# EAGLE schematic LEDCube_Par (EAGLE 5.09)
REICHELT: TASTER 3301
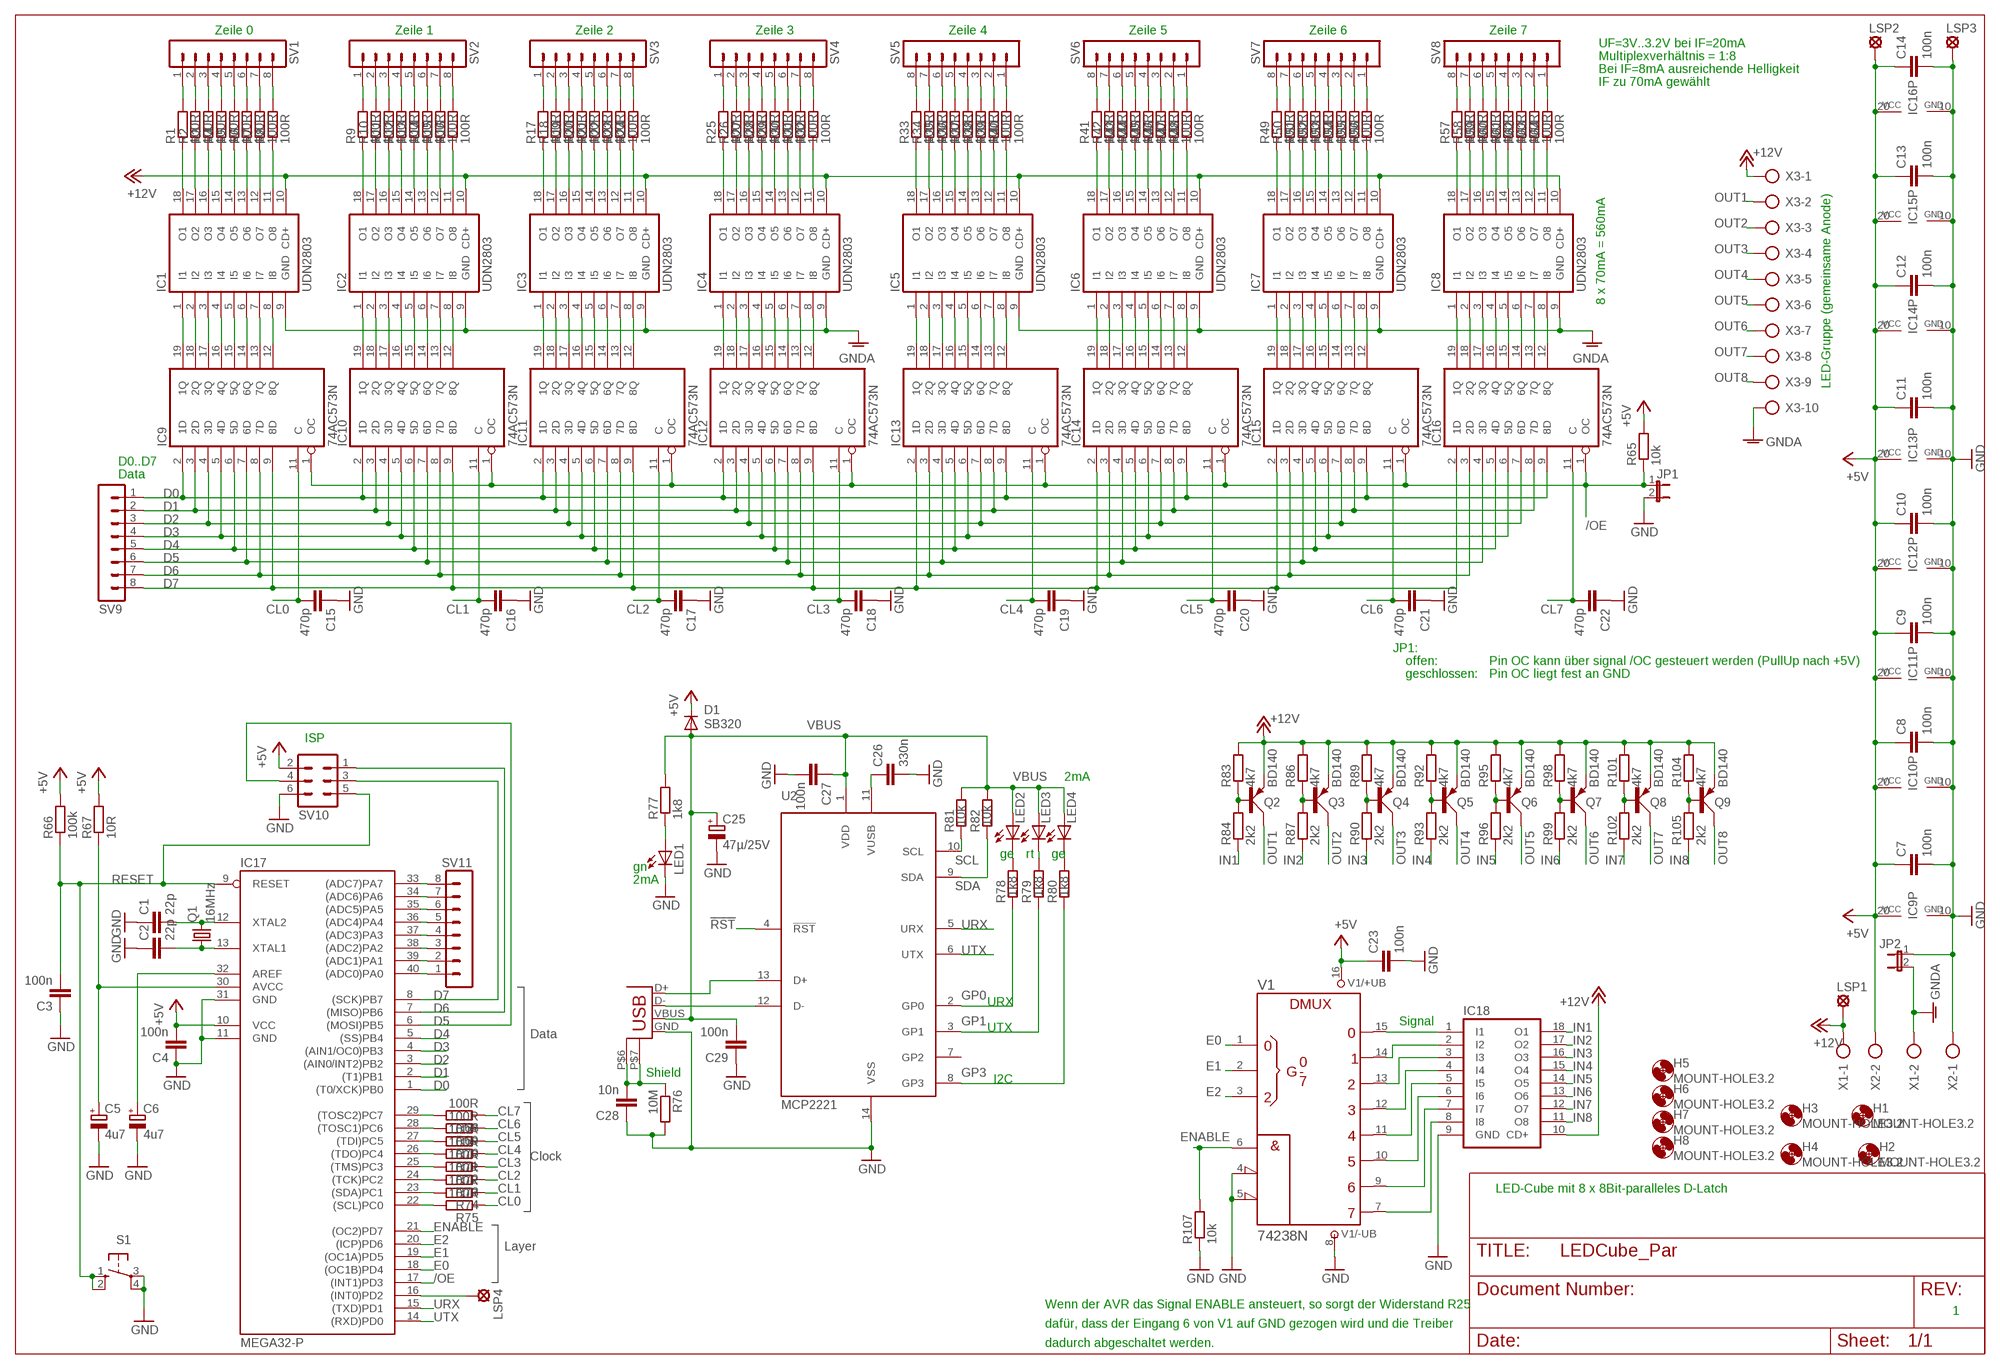
[diagram p0: schematic, sheet 1]

## Parts
C1  22p  C-EU050-025X075  [C050-025X075]
C2  22p  C-EU050-025X075  [C050-025X075]
C3  100n  C-EU050-025X075  [C050-025X075]
C4  100n  C-EU050-025X075  [C050-025X075]
C5  4u7  CPOL-EUE2-5  [E2-5]
C6  4u7  CPOL-EUE2-5  [E2-5]
C7  100n  C-EU050-030X075  [C050-030X075]
C8  100n  C-EU050-030X075  [C050-030X075]
C9  100n  C-EU050-030X075  [C050-030X075]
C10  100n  C-EU050-030X075  [C050-030X075]
C11  100n  C-EU050-030X075  [C050-030X075]
C12  100n  C-EU050-030X075  [C050-030X075]
C13  100n  C-EU050-030X075  [C050-030X075]
C14  100n  C-EU050-030X075  [C050-030X075]
C15  470p  C-EU050-025X075  [C050-025X075]
C16  470p  C-EU050-025X075  [C050-025X075]
C17  470p  C-EU050-025X075  [C050-025X075]
C18  470p  C-EU050-025X075  [C050-025X075]
C19  470p  C-EU050-025X075  [C050-025X075]
C20  470p  C-EU050-025X075  [C050-025X075]
C21  470p  C-EU050-025X075  [C050-025X075]
C22  470p  C-EU050-025X075  [C050-025X075]
C23  100n  C-EU050-025X075  [C050-025X075]
C25  47µ/25V  CPOL-EUE2-5  [E2-5]
C26  330n  C-EU050-030X075  [C050-030X075]
C27  100n  C-EU050-030X075  [C050-030X075]
C28  10n  C-EU050-030X075  [C050-030X075]
C29  100n  C-EU050-030X075  [C050-030X075]
C30  USB_SHIELED  [USB-MB-H-SHIELD]
D1  SB320  [DO201-15]
H1  MOUNT-HOLE3.2  [3,2]
H2  MOUNT-HOLE3.2  [3,2]
H3  MOUNT-HOLE3.2  [3,2]
H4  MOUNT-HOLE3.2  [3,2]
H5  MOUNT-HOLE3.2  [3,2]
H6  MOUNT-HOLE3.2  [3,2]
H7  MOUNT-HOLE3.2  [3,2]
H8  MOUNT-HOLE3.2  [3,2]
IC1  UDN2803  ULN2803A  [DIL18]
IC2  UDN2803  ULN2803A  [DIL18]
IC3  UDN2803  ULN2803A  [DIL18]
IC4  UDN2803  ULN2803A  [DIL18]
IC5  UDN2803  ULN2803A  [DIL18]
IC6  UDN2803  ULN2803A  [DIL18]
IC7  UDN2803  ULN2803A  [DIL18]
IC8  UDN2803  ULN2803A  [DIL18]
IC9  74AC573N  [DIL20]
IC10  74AC573N  [DIL20]
IC11  74AC573N  [DIL20]
IC12  74AC573N  [DIL20]
IC13  74AC573N  [DIL20]
IC14  74AC573N  [DIL20]
IC15  74AC573N  [DIL20]
IC16  74AC573N  [DIL20]
IC17  MEGA32-P  [DIL40]
IC18  ULN2803A  [DIL18]
JP1  JP1E  [JP1]
JP2  JP1E  [JP1]
LED1  LED3MM  [LED3MM]
LED2  LED3MM  [LED3MM]
LED3  LED3MM  [LED3MM]
LED4  LED3MM  [LED3MM]
LSP1  LSP10  [LSP10]
LSP2  LSP10  [LSP10]
LSP3  LSP10  [LSP10]
LSP4  LSP11  [LSP11]
Q1  16MHz  CRYSTALHC49U-V  [HC49U-V]
Q2  BD140  [TO126AV]
Q3  BD140  [TO126AV]
Q4  BD140  [TO126AV]
Q5  BD140  [TO126AV]
Q6  BD140  [TO126AV]
Q7  BD140  [TO126AV]
Q8  BD140  [TO126AV]
Q9  BD140  [TO126AV]
R1  100R  R-EU_0204/2V  [0204V]
R2  100R  R-EU_0204/2V  [0204V]
R3  100R  R-EU_0204/2V  [0204V]
R4  100R  R-EU_0204/2V  [0204V]
R5  100R  R-EU_0204/2V  [0204V]
R6  100R  R-EU_0204/2V  [0204V]
R7  100R  R-EU_0204/2V  [0204V]
R8  100R  R-EU_0204/2V  [0204V]
R9  100R  R-EU_0204/2V  [0204V]
R10  100R  R-EU_0204/2V  [0204V]
R11  100R  R-EU_0204/2V  [0204V]
R12  100R  R-EU_0204/2V  [0204V]
R13  100R  R-EU_0204/2V  [0204V]
R14  100R  R-EU_0204/2V  [0204V]
R15  100R  R-EU_0204/2V  [0204V]
R16  100R  R-EU_0204/2V  [0204V]
R17  100R  R-EU_0204/2V  [0204V]
R18  100R  R-EU_0204/2V  [0204V]
R19  100R  R-EU_0204/2V  [0204V]
R20  100R  R-EU_0204/2V  [0204V]
R21  100R  R-EU_0204/2V  [0204V]
R22  100R  R-EU_0204/2V  [0204V]
R23  100R  R-EU_0204/2V  [0204V]
R24  100R  R-EU_0204/2V  [0204V]
R25  100R  R-EU_0204/2V  [0204V]
R26  100R  R-EU_0204/2V  [0204V]
R27  100R  R-EU_0204/2V  [0204V]
R28  100R  R-EU_0204/2V  [0204V]
R29  100R  R-EU_0204/2V  [0204V]
R30  100R  R-EU_0204/2V  [0204V]
R31  100R  R-EU_0204/2V  [0204V]
R32  100R  R-EU_0204/2V  [0204V]
R33  100R  R-EU_0204/2V  [0204V]
R34  100R  R-EU_0204/2V  [0204V]
R35  100R  R-EU_0204/2V  [0204V]
R36  100R  R-EU_0204/2V  [0204V]
R37  100R  R-EU_0204/2V  [0204V]
R38  100R  R-EU_0204/2V  [0204V]
R39  100R  R-EU_0204/2V  [0204V]
R40  100R  R-EU_0204/2V  [0204V]
R41  100R  R-EU_0204/2V  [0204V]
R42  100R  R-EU_0204/2V  [0204V]
R43  100R  R-EU_0204/2V  [0204V]
R44  100R  R-EU_0204/2V  [0204V]
R45  100R  R-EU_0204/2V  [0204V]
R46  100R  R-EU_0204/2V  [0204V]
R47  100R  R-EU_0204/2V  [0204V]
R48  100R  R-EU_0204/2V  [0204V]
R49  100R  R-EU_0204/2V  [0204V]
R50  100R  R-EU_0204/2V  [0204V]
R51  100R  R-EU_0204/2V  [0204V]
R52  100R  R-EU_0204/2V  [0204V]
R53  100R  R-EU_0204/2V  [0204V]
R54  100R  R-EU_0204/2V  [0204V]
R55  100R  R-EU_0204/2V  [0204V]
R56  100R  R-EU_0204/2V  [0204V]
R57  100R  R-EU_0204/2V  [0204V]
R58  100R  R-EU_0204/2V  [0204V]
R59  100R  R-EU_0204/2V  [0204V]
R60  100R  R-EU_0204/2V  [0204V]
R61  100R  R-EU_0204/2V  [0204V]
R62  100R  R-EU_0204/2V  [0204V]
R63  100R  R-EU_0204/2V  [0204V]
R64  100R  R-EU_0204/2V  [0204V]
R65  10k  R-EU_0207/10  [0207/10]
R66  100k  R-EU_0207/10  [0207/10]
R67  10R  R-EU_0207/10  [0207/10]
R68  100R  R-EU_0207/2V  [0207/2V]
R69  100R  R-EU_0207/2V  [0207/2V]
R70  100R  R-EU_0207/2V  [0207/2V]
R71  100R  R-EU_0207/2V  [0207/2V]
R72  100R  R-EU_0207/2V  [0207/2V]
R73  100R  R-EU_0207/2V  [0207/2V]
R74  100R  R-EU_0207/2V  [0207/2V]
R75  100R  R-EU_0207/2V  [0207/2V]
R76  10M  R-EU_0207/10  [0207/10]
R77  1k8  R-EU_0207/2V  [0207/2V]
R78  1k8  R-EU_0207/2V  [0207/2V]
R79  1k8  R-EU_0207/2V  [0207/2V]
R80  1k8  R-EU_0207/2V  [0207/2V]
R81  10k  R-EU_0207/2V  [0207/2V]
R82  10k  R-EU_0207/2V  [0207/2V]
R83  4k7  R-EU_0207/10  [0207/10]
R84  2k2  R-EU_0207/2V  [0207/2V]
R86  4k7  R-EU_0207/10  [0207/10]
R87  2k2  R-EU_0207/2V  [0207/2V]
R89  4k7  R-EU_0207/10  [0207/10]
R90  2k2  R-EU_0207/2V  [0207/2V]
R92  4k7  R-EU_0207/10  [0207/10]
R93  2k2  R-EU_0207/2V  [0207/2V]
R95  4k7  R-EU_0207/10  [0207/10]
R96  2k2  R-EU_0207/2V  [0207/2V]
R98  4k7  R-EU_0207/10  [0207/10]
R99  2k2  R-EU_0207/2V  [0207/2V]
R101  4k7  R-EU_0207/10  [0207/10]
R102  2k2  R-EU_0207/2V  [0207/2V]
R104  4k7  R-EU_0207/10  [0207/10]
R105  2k2  R-EU_0207/2V  [0207/2V]
R107  10k  R-EU_0207/10  [0207/10]
S1  10-XX  [B3F-10XX]
SV1  MA08-1  [MA08-1]
SV2  MA08-1  [MA08-1]
SV3  MA08-1  [MA08-1]
SV4  MA08-1  [MA08-1]
SV5  MA08-1  [MA08-1]
SV6  MA08-1  [MA08-1]
SV7  MA08-1  [MA08-1]
SV8  MA08-1  [MA08-1]
SV9  MA08-1  [MA08-1]
SV10  ML6  [ML6]
SV11  MA08-1  [MA08-1]
U2  MCP2221  [DIL14]
V1  74238N  [DIL16]
X1  AK500/2  [AK500/2]
X2  AK500/2  [AK500/2]
X3  AK500/10  [AK500/10]

## Nets
!RST: U2.4(!RST)
+5V: C4.2 C7.1 C8.1 C9.1 C10.1 C11.1 C12.1 C13.1 C14.1 C23.1 D1.C IC9.20(VCC) IC10.20(VCC) IC11.20(VCC) IC12.20(VCC) IC13.20(VCC) IC14.20(VCC) IC15.20(VCC) IC16.20(VCC) IC17.10(VCC) LSP2.MP R65.2 R66.2 R67.2 SV10.2 V1.16(+UB) X2.2
+12V: IC1.10(CD+) IC2.10(CD+) IC3.10(CD+) IC4.10(CD+) IC5.10(CD+) IC6.10(CD+) IC7.10(CD+) IC8.10(CD+) IC18.10(CD+) LSP1.MP Q2.E Q3.E Q4.E Q5.E Q6.E Q7.E Q8.E Q9.E R83.2 R86.2 R89.2 R92.2 R95.2 R98.2 R101.2 R104.2 X1.1 X3.1
/OE: IC9.1(OC) IC10.1(OC) IC11.1(OC) IC12.1(OC) IC13.1(OC) IC14.1(OC) IC15.1(OC) IC16.1(OC) IC17.17((INT1)PD3) JP1.1 R65.1
CL0: C15.2 IC9.11(C) R75.1
CL1: C16.2 IC10.11(C) R74.1
CL2: C17.2 IC11.11(C) R73.1
CL3: C18.2 IC12.11(C) R72.1
CL4: C19.2 IC13.11(C) R71.1
CL5: C20.2 IC14.11(C) R70.1
CL6: C21.2 IC15.11(C) R69.1
CL7: C22.2 IC16.11(C) R68.1
D0: IC9.2(1D) IC10.2(1D) IC11.2(1D) IC12.2(1D) IC13.9(8D) IC14.9(8D) IC15.9(8D) IC16.9(8D) IC17.1((T0/XCK)PB0) SV9.1
D1: IC9.3(2D) IC10.3(2D) IC11.3(2D) IC12.3(2D) IC13.8(7D) IC14.8(7D) IC15.8(7D) IC16.8(7D) IC17.2((T1)PB1) SV9.2
D2: IC9.4(3D) IC10.4(3D) IC11.4(3D) IC12.4(3D) IC13.7(6D) IC14.7(6D) IC15.7(6D) IC16.7(6D) IC17.3((AIN0/INT2)PB2) SV9.3
D3: IC9.5(4D) IC10.5(4D) IC11.5(4D) IC12.5(4D) IC13.6(5D) IC14.6(5D) IC15.6(5D) IC16.6(5D) IC17.4((AIN1/OC0)PB3) SV9.4
D4: IC9.6(5D) IC10.6(5D) IC11.6(5D) IC12.6(5D) IC13.5(4D) IC14.5(4D) IC15.5(4D) IC16.5(4D) IC17.5((SS)PB4) SV9.5
D5: IC9.7(6D) IC10.7(6D) IC11.7(6D) IC12.7(6D) IC13.4(3D) IC14.4(3D) IC15.4(3D) IC16.4(3D) IC17.6((MOSI)PB5) SV9.6 SV10.4
D6: IC9.8(7D) IC10.8(7D) IC11.8(7D) IC12.8(7D) IC13.3(2D) IC14.3(2D) IC15.3(2D) IC16.3(2D) IC17.7((MISO)PB6) SV9.7 SV10.1
D7: IC9.9(8D) IC10.9(8D) IC11.9(8D) IC12.9(8D) IC13.2(1D) IC14.2(1D) IC15.2(1D) IC16.2(1D) IC17.8((SCK)PB7) SV9.8 SV10.3
E0: IC17.18((OC1B)PD4) V1.1(A)
E1: IC17.19((OC1A)PD5) V1.2(B)
E2: IC17.20((ICP)PD6) V1.3(C)
ENABLE: IC17.21((OC2)PD7) R107.2 V1.6(G1)
GND: C1.1 C2.1 C3.1 C4.1 C5.- C6.- C7.2 C8.2 C9.2 C10.2 C11.2 C12.2 C13.2 C14.2 C15.1 C16.1 C17.1 C18.1 C19.1 C20.1 C21.1 C22.1 C23.2 C25.- C26.2 C27.2 C28.1 C29.1 C30.GND IC9.10(GND) IC10.10(GND) IC11.10(GND) IC12.10(GND) IC13.10(GND) IC14.10(GND) IC15.10(GND) IC16.10(GND) IC17.11(GND) IC17.31(GND) IC18.9(GND) JP1.2 JP2.1 LED1.K(C) LSP3.MP R76.2 R107.1 S1.3(P) S1.4(P1) SV10.6 U2.14(VSS) V1.4(!G2A) V1.5(!G2B) V1.8(-UB) X2.1
GNDA: IC1.9(GND) IC2.9(GND) IC3.9(GND) IC4.9(GND) IC5.9(GND) IC6.9(GND) IC7.9(GND) IC8.9(GND) JP2.2 X1.2 X3.10
GP0: R78.1 U2.2(GP0)
GP1: R79.1 U2.3(GP1)
GP3: R80.1 U2.8(GP3)
IN1: IC18.18(O1) R84.1
IN2: IC18.17(O2) R87.1
IN3: IC18.16(O3) R90.1
IN4: IC18.15(O4) R93.1
IN5: IC18.14(O5) R96.1
IN6: IC18.13(O6) R99.1
IN7: IC18.12(O7) R102.1
IN8: IC18.11(O8) R105.1
N$1: IC1.1(I1) IC9.19(1Q)
N$2: IC1.2(I2) IC9.18(2Q)
N$3: IC1.3(I3) IC9.17(3Q)
N$4: IC1.4(I4) IC9.16(4Q)
N$5: IC1.5(I5) IC9.15(5Q)
N$6: IC1.6(I6) IC9.14(6Q)
N$7: IC1.7(I7) IC9.13(7Q)
N$8: IC1.8(I8) IC9.12(8Q)
N$9: IC2.1(I1) IC10.19(1Q)
N$10: IC2.2(I2) IC10.18(2Q)
N$11: IC2.3(I3) IC10.17(3Q)
N$12: IC2.4(I4) IC10.16(4Q)
N$13: IC2.5(I5) IC10.15(5Q)
N$14: IC2.6(I6) IC10.14(6Q)
N$15: IC2.7(I7) IC10.13(7Q)
N$16: IC2.8(I8) IC10.12(8Q)
N$17: IC3.1(I1) IC11.19(1Q)
N$18: IC3.2(I2) IC11.18(2Q)
N$19: IC3.3(I3) IC11.17(3Q)
N$20: IC3.4(I4) IC11.16(4Q)
N$21: IC3.5(I5) IC11.15(5Q)
N$22: IC3.6(I6) IC11.14(6Q)
N$23: IC3.7(I7) IC11.13(7Q)
N$24: IC3.8(I8) IC11.12(8Q)
N$25: IC4.1(I1) IC12.19(1Q)
N$26: IC4.2(I2) IC12.18(2Q)
N$27: IC4.3(I3) IC12.17(3Q)
N$28: IC4.4(I4) IC12.16(4Q)
N$29: IC4.5(I5) IC12.15(5Q)
N$30: IC4.6(I6) IC12.14(6Q)
N$31: IC4.7(I7) IC12.13(7Q)
N$32: IC4.8(I8) IC12.12(8Q)
N$33: IC17.16((INT0)PD2) LSP4.MP
N$34: R49.2 SV7.8
N$35: R50.2 SV7.7
N$36: R51.2 SV7.6
N$37: R52.2 SV7.5
N$38: R53.2 SV7.4
N$39: R54.2 SV7.3
N$40: R55.2 SV7.2
N$41: R56.2 SV7.1
N$42: IC2.18(O1) R9.1
N$43: IC1.18(O1) R1.1
N$44: R41.2 SV6.8
N$45: IC5.1(I1) IC13.19(1Q)
N$46: IC5.2(I2) IC13.18(2Q)
N$47: IC5.3(I3) IC13.17(3Q)
N$48: IC1.17(O2) R2.1
N$49: IC1.16(O3) R3.1
N$50: IC1.15(O4) R4.1
N$51: IC1.14(O5) R5.1
N$52: IC1.13(O6) R6.1
N$53: IC1.12(O7) R7.1
N$54: IC1.11(O8) R8.1
N$55: IC4.11(O8) R32.1
N$56: IC4.12(O7) R31.1
N$57: IC4.13(O6) R30.1
N$58: IC4.14(O5) R29.1
N$59: IC4.15(O4) R28.1
N$60: IC4.16(O3) R27.1
N$61: IC4.17(O2) R26.1
N$62: IC4.18(O1) R25.1
N$63: R1.2 SV1.1
N$64: IC5.4(I4) IC13.16(4Q)
N$65: IC2.17(O2) R10.1
N$66: IC5.5(I5) IC13.15(5Q)
N$67: IC2.16(O3) R11.1
N$68: IC5.6(I6) IC13.14(6Q)
N$69: IC5.7(I7) IC13.13(7Q)
N$70: IC2.15(O4) R12.1
N$71: IC5.8(I8) IC13.12(8Q)
N$72: IC6.1(I1) IC14.19(1Q)
N$73: IC6.2(I2) IC14.18(2Q)
N$74: IC6.3(I3) IC14.17(3Q)
N$75: IC2.14(O5) R13.1
N$76: IC2.13(O6) R14.1
N$77: IC2.12(O7) R15.1
N$78: IC2.11(O8) R16.1
N$79: IC3.18(O1) R17.1
N$80: IC3.17(O2) R18.1
N$81: IC3.16(O3) R19.1
N$82: IC3.15(O4) R20.1
N$83: IC3.14(O5) R21.1
N$84: IC3.13(O6) R22.1
N$85: IC3.12(O7) R23.1
N$86: IC6.4(I4) IC14.16(4Q)
N$87: IC6.5(I5) IC14.15(5Q)
N$88: IC3.11(O8) R24.1
N$89: IC6.6(I6) IC14.14(6Q)
N$90: IC6.7(I7) IC14.13(7Q)
N$91: IC6.8(I8) IC14.12(8Q)
N$92: IC7.1(I1) IC15.19(1Q)
N$93: IC7.2(I2) IC15.18(2Q)
N$94: IC7.3(I3) IC15.17(3Q)
N$95: IC7.4(I4) IC15.16(4Q)
N$96: IC7.5(I5) IC15.15(5Q)
N$97: IC7.6(I6) IC15.14(6Q)
N$98: IC7.7(I7) IC15.13(7Q)
N$99: IC7.8(I8) IC15.12(8Q)
N$100: IC8.1(I1) IC16.19(1Q)
N$101: IC8.2(I2) IC16.18(2Q)
N$102: IC8.3(I3) IC16.17(3Q)
N$103: IC8.4(I4) IC16.16(4Q)
N$104: IC8.5(I5) IC16.15(5Q)
N$105: IC8.6(I6) IC16.14(6Q)
N$106: IC8.7(I7) IC16.13(7Q)
N$107: C1.2 IC17.12(XTAL2) Q1.2
N$108: IC8.8(I8) IC16.12(8Q)
N$109: R42.2 SV6.7
N$110: R43.2 SV6.6
N$111: R44.2 SV6.5
N$112: R45.2 SV6.4
N$113: R46.2 SV6.3
N$114: R47.2 SV6.2
N$115: R48.2 SV6.1
N$116: Q2.B R83.1 R84.2
N$117: IC5.18(O1) R33.1
N$118: IC5.17(O2) R34.1
N$119: IC5.16(O3) R35.1
N$120: IC5.15(O4) R36.1
N$121: IC5.14(O5) R37.1
N$122: R2.2 SV1.2
N$123: R3.2 SV1.3
N$124: R4.2 SV1.4
N$125: R5.2 SV1.5
N$126: R6.2 SV1.6
N$127: R7.2 SV1.7
N$128: R8.2 SV1.8
N$129: R9.2 SV2.1
N$130: IC5.13(O6) R38.1
N$131: IC5.12(O7) R39.1
N$132: IC5.11(O8) R40.1
N$133: IC8.11(O8) R64.1
N$134: IC8.12(O7) R63.1
N$135: IC8.13(O6) R62.1
N$136: IC8.14(O5) R61.1
N$137: IC8.15(O4) R60.1
N$138: IC8.16(O3) R59.1
N$139: IC8.17(O2) R58.1
N$140: IC8.18(O1) R57.1
N$141: IC6.18(O1) R41.1
N$142: IC6.17(O2) R42.1
N$143: IC6.16(O3) R43.1
N$144: IC6.15(O4) R44.1
N$145: IC6.14(O5) R45.1
N$146: IC6.13(O6) R46.1
N$147: IC6.12(O7) R47.1
N$148: IC6.11(O8) R48.1
N$149: IC7.18(O1) R49.1
N$150: R10.2 SV2.2
N$151: IC7.17(O2) R50.1
N$152: IC7.16(O3) R51.1
N$153: IC7.15(O4) R52.1
N$154: IC7.14(O5) R53.1
N$155: IC7.13(O6) R54.1
N$156: IC7.12(O7) R55.1
N$157: IC7.11(O8) R56.1
N$158: R33.2 SV5.8
N$159: R34.2 SV5.7
N$160: R35.2 SV5.6
N$161: R36.2 SV5.5
N$162: R37.2 SV5.4
N$163: R38.2 SV5.3
N$164: R39.2 SV5.2
N$165: R40.2 SV5.1
N$166: R57.2 SV8.8
N$167: R11.2 SV2.3
N$168: R12.2 SV2.4
N$169: R13.2 SV2.5
N$170: R14.2 SV2.6
N$171: R15.2 SV2.7
N$172: R16.2 SV2.8
N$173: R17.2 SV3.1
N$174: R18.2 SV3.2
N$175: R19.2 SV3.3
N$176: R20.2 SV3.4
N$177: R21.2 SV3.5
N$178: R22.2 SV3.6
N$179: R23.2 SV3.7
N$180: R24.2 SV3.8
N$181: R25.2 SV4.1
N$182: R26.2 SV4.2
N$183: R27.2 SV4.3
N$184: R28.2 SV4.4
N$185: R29.2 SV4.5
N$186: R30.2 SV4.6
N$187: R31.2 SV4.7
N$188: R32.2 SV4.8
N$189: R58.2 SV8.7
N$190: R59.2 SV8.6
N$191: R60.2 SV8.5
N$192: R61.2 SV8.4
N$193: R62.2 SV8.3
N$194: R63.2 SV8.2
N$195: R64.2 SV8.1
N$196: C30.D- U2.12(D-)
N$197: C30.D+ U2.13(D+)
N$198: C26.1 U2.11(VUSB)
N$199: C28.2 C30.P$6(SHIELD1) C30.P$7(SHIELD) R76.1
N$200: LED1.A R77.1
N$201: Q3.B R86.1 R87.2
N$202: LED2.K(C) R78.2
N$203: C2.2 IC17.13(XTAL1) Q1.1
N$204: C5.+ IC17.30(AVCC) R67.1
N$205: C6.+ IC17.32(AREF)
N$206: LED3.K(C) R79.2
N$207: LED4.K(C) R80.2
N$208: Q4.B R89.1 R90.2
N$209: Q5.B R92.1 R93.2
N$210: Q6.B R95.1 R96.2
N$211: Q7.B R98.1 R99.2
N$212: Q8.B R101.1 R102.2
N$213: Q9.B R104.1 R105.2
N$214: IC18.1(I1) V1.15(Y0)
N$216: IC17.29((TOSC2)PC7) R68.2
N$217: IC17.28((TOSC1)PC6) R69.2
N$218: IC17.27((TDI)PC5) R70.2
N$219: IC17.26((TDO)PC4) R71.2
N$220: IC17.25((TMS)PC3) R72.2
N$221: IC17.24((TCK)PC2) R73.2
N$222: IC17.23((SDA)PC1) R74.2
N$223: IC17.22((SCL)PC0) R75.2
N$224: IC18.2(I2) V1.14(Y1)
N$225: IC18.3(I3) V1.13(Y2)
N$226: IC18.4(I4) V1.12(Y3)
N$227: IC18.5(I5) V1.11(Y4)
N$228: IC18.6(I6) V1.10(Y5)
N$229: IC18.7(I7) V1.9(Y6)
N$230: IC18.8(I8) V1.7(Y7)
N$231: IC17.40((ADC0)PA0) SV11.1
N$232: IC17.39((ADC1)PA1) SV11.2
N$233: IC17.38((ADC2)PA2) SV11.3
N$234: IC17.37((ADC3)PA3) SV11.4
N$235: IC17.36((ADC4)PA4) SV11.5
N$236: IC17.35((ADC5)PA5) SV11.6
N$237: IC17.34((ADC6)PA6) SV11.7
N$238: IC17.33((ADC7)PA7) SV11.8
OUT1: Q2.C X3.2
OUT2: Q3.C X3.3
OUT3: Q4.C X3.4
OUT4: Q5.C X3.5
OUT5: Q6.C X3.6
OUT6: Q7.C X3.7
OUT7: Q8.C X3.8
OUT8: Q9.C X3.9
RESET: C3.2 IC17.9(RESET) R66.1 S1.1(S) S1.2(S1) SV10.5
SCL: R81.1 U2.10(SCL)
SDA: R82.1 U2.9(SDA)
URX: IC17.15((TXD)PD1) U2.5(URX)
UTX: IC17.14((RXD)PD0) U2.6(UTX)
VBUS: C25.+ C27.1 C29.2 C30.VBUS D1.A LED2.A LED3.A LED4.A R77.2 R81.2 R82.2 U2.1(VDD)
Unconnected: U2.7(GP2)

## Notes on the sheet
- Zeile 0 | Zeile 1 | Zeile 2 | Zeile 3 | Zeile 4 | Zeile 5 | Zeile 6 | Zeile 7
- UF=3V..3.2V bei IF=20mA
- Multiplexverhältnis = 1:8
- Bei IF=8mA ausreichende Helligkeit
- IF zu 70mA gewählt
- 8 x 70mA = 560mA
- LED-Gruppe (gemeinsame Anode)
- D0..D7
- Data
- JP1:
- offen: | Pin OC kann über signal /OC gesteuert werden (PullUp nach +5V)
- geschlossen: | Pin OC liegt fest an GND
- ISP
- 2mA
- ge | rt | ge
- gn
- 2mA
- URX
- Signal
- UTX
- Data
- Shield
- I2C
- Clock
- LED-Cube mit 8 x 8Bit-paralleles D-Latch
- Layer
- Wenn der AVR das Signal ENABLE ansteuert, so sorgt der Widerstand R25
- 1
- dafür, dass der Eingang 6 von V1 auf GND gezogen wird und die Treiber
- dadurch abgeschaltet werden.

## Library data of the parts
C1-C4 C7-C23 C26-C29 = bbstghs:C-EU: CAPACITOR, European symbol
C5 C6 C25 = bbstghs:CPOL-EU: POLARIZED CAPACITOR, European symbol
C30 = con-usb:USB_SHIELED
D1 = bbstghs:SB320: DIODE barrier rectifier, 3 A (Fairchild)
H1-H8 = holes:MOUNT-HOLE: MOUNTING HOLE with drill center marker
IC1-IC8 IC18 = uln-udn:ULN2803A: DRIVER ARRAY
IC9-IC16 = 74xx-eu:74*573: 8-bit D latch BUS DRIVER
IC17 = atmel:MEGA32-P: MICROCONTROLLER 32 Kbytes FLASH 2 Kbytes SRAM 1 Kbytes EEPROM USART 8-channel 10 bit ADC Source: www.atmel.com .. doc2503.pdf
JP1 JP2 = bbstghs:JP1E: JUMPER
LED1-LED4 = bbstghs:LED: LED OSRAM: - CHIPLED LG R971, LG N971, LY N971, LG Q971, LY Q971, LO R971, LY R971 LH N974, LH R974 LS Q976, LO Q976, LY Q976 LO Q996 - Hyper CHIPLED LW Q18S LB Q993, LB Q99A, LB R99A - SideLED LS A670, LO A670, LY A670, LG A670, LP A670 LB A673, LV A673, LT A673, LW A673 LH A674 LY A675 LS A676, LA A676, LO A676, LY A676, LW A676 LS A679, LY A679, LG A679 - Hyper Micro SIDELED® LS Y876, LA Y876, LO Y876, LY Y876 LT Y87S - SmartLED LW L88C, LW L88S LB L89C, LB L89S, LG L890 LS L89K, LO L89K, LY L89K LS L896, LA L896, LO L896, LY L896 - TOPLED LS T670, LO T670, LY T670, LG T670, LP T670 LSG T670, LSP T670, LSY T670, LOP T670, LYG T670 LG T671, LOG T671, LSG T671 LB T673, LV T673, LT T673, LW T673 LH T674 LS T676, LA T676, LO T676, LY T676, LB T676, LH T676, LSB T676, LW T676 LB T67C, LV T67C, LT T67C, LS T67K, LO T67K, LY T67K, LW E67C LS E67B, LA E67B, LO E67B, LY E67B, LB E67C, LV E67C, LT E67C LW T67C LS T679, LY T679, LG T679 LS T770, LO T770, LY T770, LG T770, LP T770 LB T773, LV T773, LT T773, LW T773 LH T774 LS E675, LA E675, LY E675, LS T675 LS T776, LA T776, LO T776, LY T776, LB T776 LHGB T686 LT T68C, LB T68C - Hyper Mini TOPLED® LB M676 - Mini TOPLED Santana® LG M470 LS M47K, LO M47K, LY M47K Source: http://www.osram.convergy.de LUXEON: - LUMILED® LXK2-PW12-R00, LXK2-PW12-S00, LXK2-PW14-U00, LXK2-PW14-V00 LXK2-PM12-R00, LXK2-PM12-S00, LXK2-PM14-U00 LXK2-PE12-Q00, LXK2-PE12-R00, LXK2-PE12-S00, LXK2-PE14-T00, LXK2-PE14-U00 LXK2-PB12-K00, LXK2-PB12-L00, LXK2-PB12-M00, LXK2-PB14-N00, LXK2-PB14-P00, LXK2-PB14-Q00 LXK2-PR12-L00, LXK2-PR12-M00, LXK2-PR14-Q00, LXK2-PR14-R00 LXK2-PD12-Q00, LXK2-PD12-R00, LXK2-PD12-S00 LXK2-PH12-R00, LXK2-PH12-S00 LXK2-PL12-P00, LXK2-PL12-Q00, LXK2-PL12-R00 Source: www.luxeon.com KINGBRIGHT: KA-3528ASYC Source: www.kingbright.com
LSP1-LSP3 = solpad:LSP10: SOLDER PAD drill 1.0 mm, distributor Buerklin, 12H555
LSP4 = solpad:LSP11: SOLDER PAD drill 1.1 mm
Q1 = bbstghs:CRYSTAL: CRYSTAL
Q2-Q9 = transistor-power:BD140: PNP TRANSISTOR
R1-R84 R86 R87 R89 R90 R92 R93 R95 R96 R98 R99 R101 R102 R104 R105 R107 = bbstghs:R-EU_: RESISTOR, European symbol
S1 = switch-omron:10-XX: OMRON SWITCH
SV1-SV9 SV11 = con-lstb:MA08-1: PIN HEADER
SV10 = bbstghs:ML6: HARTING
U2 = bbstghs:MCP2221
V1 = 74ttl-din:74*238: 1 of 8 noninverting DECODER/DEMULTIPLEXER
X1 X2 = bbstghs:AK500/2: CONNECTOR
X3 = con-ptr500:AK500/10: CONNECTOR